# Altium schematic sheet sch2.SchDoc
size 420 x 297 mm; Address1: Address1; Address2: Address2; Address3: Address3; Address4: Address4; DocumentNumber: АБВГ.123456.001 Э3; SheetNumber: 1; Scale: 1:1; DocumentType: Схема электрическая принципиальная; FirstReferrence: АБВГ.123456.001
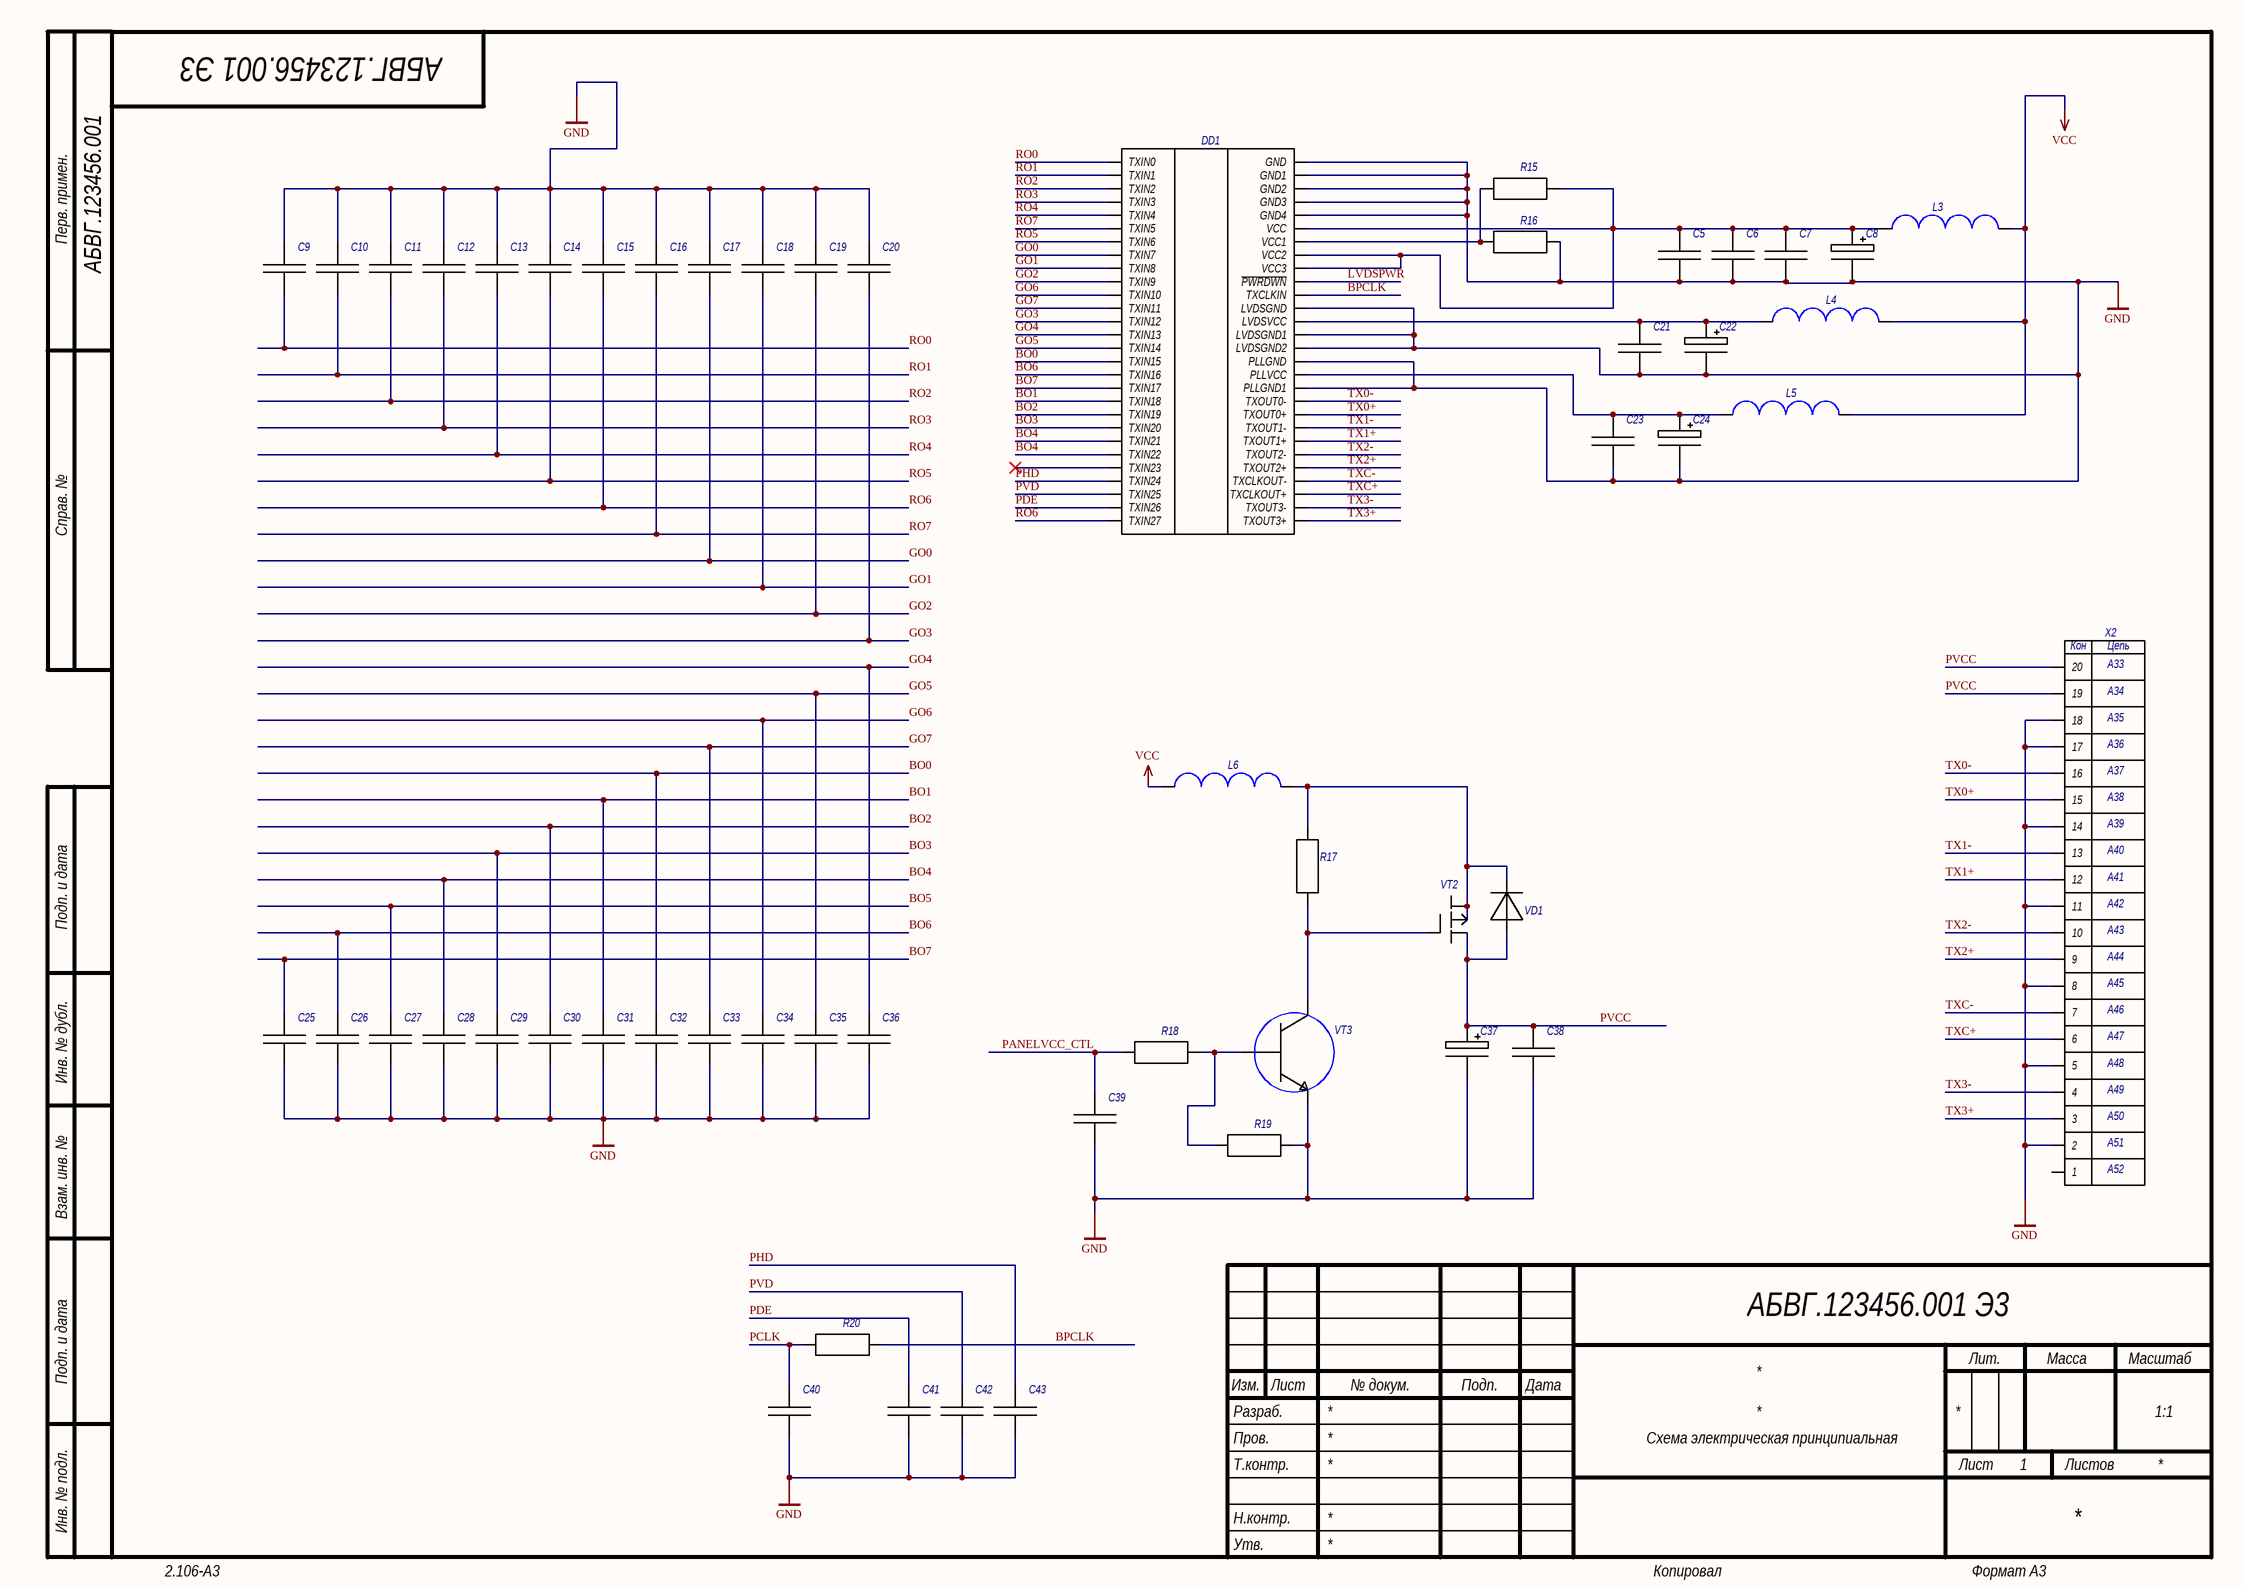
[diagram p0: sch2.SchDoc]

## Parts
C5  *  [Capacitor 0805]  (value not drawn)
C6  *  [Capacitor 0805]  (value not drawn)
C7  *  [Capacitor 0805]  (value not drawn)
C8  *  [Capacitor 0805]  (value not drawn)
C9  *  [Capacitor 0805]  (value not drawn)
C10  *  [Capacitor 0805]  (value not drawn)
C11  *  [Capacitor 0805]  (value not drawn)
C12  *  [Capacitor 0805]  (value not drawn)
C13  *  [Capacitor 0805]  (value not drawn)
C14  *  [Capacitor 0805]  (value not drawn)
C15  *  [Capacitor 0805]  (value not drawn)
C16  *  [Capacitor 0805]  (value not drawn)
C17  *  [Capacitor 0805]  (value not drawn)
C18  *  [Capacitor 0805]  (value not drawn)
C19  *  [Capacitor 0805]  (value not drawn)
C20  *  [Capacitor 0805]  (value not drawn)
C21  *  [Capacitor 0805]  (value not drawn)
C22  *  [Capacitor 0805]  (value not drawn)
C23  *  [Capacitor 0805]  (value not drawn)
C24  *  [Capacitor 0805]  (value not drawn)
C25  *  [Capacitor 0805]  (value not drawn)
C26  *  [Capacitor 0805]  (value not drawn)
C27  *  [Capacitor 0805]  (value not drawn)
C28  *  [Capacitor 0805]  (value not drawn)
C29  *  [Capacitor 0805]  (value not drawn)
C30  *  [Capacitor 0805]  (value not drawn)
C31  *  [Capacitor 0805]  (value not drawn)
C32  *  [Capacitor 0805]  (value not drawn)
C33  *  [Capacitor 0805]  (value not drawn)
C34  *  [Capacitor 0805]  (value not drawn)
C35  *  [Capacitor 0805]  (value not drawn)
C36  *  [Capacitor 0805]  (value not drawn)
C37  *  [Capacitor 0805]  (value not drawn)
C38  *  [Capacitor 0805]  (value not drawn)
C39  *  [Capacitor 0805]  (value not drawn)
C40  *  [Capacitor 0805]  (value not drawn)
C41  *  [Capacitor 0805]  (value not drawn)
C42  *  [Capacitor 0805]  (value not drawn)
C43  *  [Capacitor 0805]  (value not drawn)
DD1  *  [THC63_1]  (value not drawn)
L3  *  [Inductor 2520]  (value not drawn)
L4  *  [Inductor 2520]  (value not drawn)
L5  *  [Inductor 2520]  (value not drawn)
L6  *  [Inductor 2520]  (value not drawn)
R15  *  [Resistor 1206]  (value not drawn)
R16  *  [Resistor 1206]  (value not drawn)
R17  *  [Resistor 1206]  (value not drawn)
R18  *  [Resistor 1206]  (value not drawn)
R19  *  [Resistor 1206]  (value not drawn)
R20  *  [Resistor 1206]  (value not drawn)
VD1  Diode 1  [Diode]  (value not drawn)
VT2  MOP TRANSISTOR  [TR]  (value not drawn)
VT3  *  [Transistor 1]  (value not drawn)
X2  *  [DF14A]  (value not drawn)

## Nets
GND: C5.1 C6.1 C7.1 C8.1 C9.2 C10.2 C11.2 C12.2 C13.2 C14.2 C15.2 C16.2 C17.2 C18.2 C19.2 C20.2 C21.1 C22.1 C23.1 C24.1 C25.1 C26.1 C27.1 C28.1 C29.1 C30.1 C31.1 C32.1 C33.1 C34.1 C35.1 C36.1 C37.1 C38.1 C39.1 C40.1 C41.1 C42.1 C43.1 DD1.39(PLLGND1) DD1.41(PLLGND) DD1.42(LVDSGND2) DD1.43(LVDSGND1) DD1.45(LVDSGND) DD1.52(GND4) DD1.53(GND3) DD1.54(GND2) DD1.55(GND1) DD1.56(GND) R16.2 R19.2 VT3.1(KOLLECTOR) X2.2 X2.5 X2.8 X2.11 X2.14 X2.17 X2.18
VCC: L3.2 L4.2 L5.2 L6.1
BO0: C32.2 DD1.16(TXIN15)
BO1: C31.2 DD1.19(TXIN18)
BO2: C30.2 DD1.20(TXIN19)
BO3: C29.2 DD1.21(TXIN20)
BO4: C28.2 DD1.22(TXIN21) DD1.23(TXIN22)
BO5: C27.2
BO6: C26.2 DD1.17(TXIN16)
BO7: C25.2 DD1.18(TXIN17)
BPCLK: DD1.46(TXCLKIN) R20.2
GO0: C17.1 DD1.8(TXIN7)
GO1: C18.1 DD1.9(TXIN8)
GO2: C19.1 DD1.10(TXIN9)
GO3: C20.1 DD1.13(TXIN12)
GO4: C36.2 DD1.14(TXIN13)
GO5: C35.2 DD1.15(TXIN14)
GO6: C34.2 DD1.11(TXIN10)
GO7: C33.2 DD1.12(TXIN11)
LVDSPWR: DD1.47(~{PWRDWN})
PANELVCC_CTL: C39.2 R18.1
PCLK: C40.2 R20.1
PDE: C41.2 DD1.27(TXIN26)
PHD: C43.2 DD1.25(TXIN24)
PVCC: C37.2 C38.2 VD1.1 VT2.2 X2.19 X2.20
PVD: C42.2 DD1.26(TXIN25)
RO0: C9.1 DD1.1(TXIN0)
RO1: C10.1 DD1.2(TXIN1)
RO2: C11.1 DD1.3(TXIN2)
RO3: C12.1 DD1.4(TXIN3)
RO4: C13.1 DD1.5(TXIN4)
RO5: C14.1 DD1.7(TXIN6)
RO6: C15.1 DD1.28(TXIN27)
RO7: C16.1 DD1.6(TXIN5)
TX0+: DD1.37(TXOUT0+) X2.15
TX0-: DD1.38(TXOUT0-) X2.16
TX1+: DD1.35(TXOUT1+) X2.12
TX1-: DD1.36(TXOUT1-) X2.13
TX2+: DD1.33(TXOUT2+) X2.9
TX2-: DD1.34(TXOUT2-) X2.10
TX3+: DD1.29(TXOUT3+) X2.3
TX3-: DD1.30(TXOUT3-) X2.4
TXC+: DD1.31(TXCLKOUT+) X2.6
TXC-: DD1.32(TXCLKOUT-) X2.7
NetC5_2: C5.2 C6.2 C7.2 C8.2 DD1.48(VCC3) DD1.49(VCC2) DD1.51(VCC) L3.1 R15.2
NetC21_2: C21.2 C22.2 DD1.44(LVDSVCC) L4.1
NetC23_2: C23.2 C24.2 DD1.40(PLLVCC) L5.1
NetDD1_50: DD1.50(VCC1) R15.1 R16.1
NetL6_2: L6.2 R17.2 VD1.2 VT2.3 VT2.4
NetR17_1: R17.1 VT2.1 VT3.2(EMITTER)
NetR18_2: R18.2 R19.1 VT3.3(BAZA)

Not connected (* = marked no-connect by the designer): DD1 24(TXIN23)*; X2 1

## Notes on the sheet
- Перв. примен.
- Справ. №
- Подп. и дата
- Инв. № дубл.
- Взам. инв. №
- Разраб.
- Изм.
- Лист
- № докум.
- Подп.
- Дата
- Лит.
- Масса
- Масштаб
- Пров.
- Т.контр.
- Листов
- Инв. № подл.
- Утв.
- Н.контр.
- 2.106-A3
- Копировал
- Формат А3
- (in symbol DF14A) Кон; Цепь; A33; A34; A35; A36; A37; A38; A39; A40; A41; A42; A43; A44; A45; A46; A47; A48; A49; A50; A51; A52

## Library data of the parts
C5-C7 C9-C21 C23 C25-C36 C38-C43 = Capacitor: Model: *
C8 C22 C24 C37 = Capacitor Duga: Model: *
DD1 = THC63
L3-L6 = Inductor: Model: *
R15-R20 = Resistor: Model: *
VT3 = Transistor 1
X2 = DF14A
VD1 = Diode 1: Model: *